# Altium schematic sheet Transconductance.SchDoc
size A4; SheetNumber: 2; SheetTotal: 3
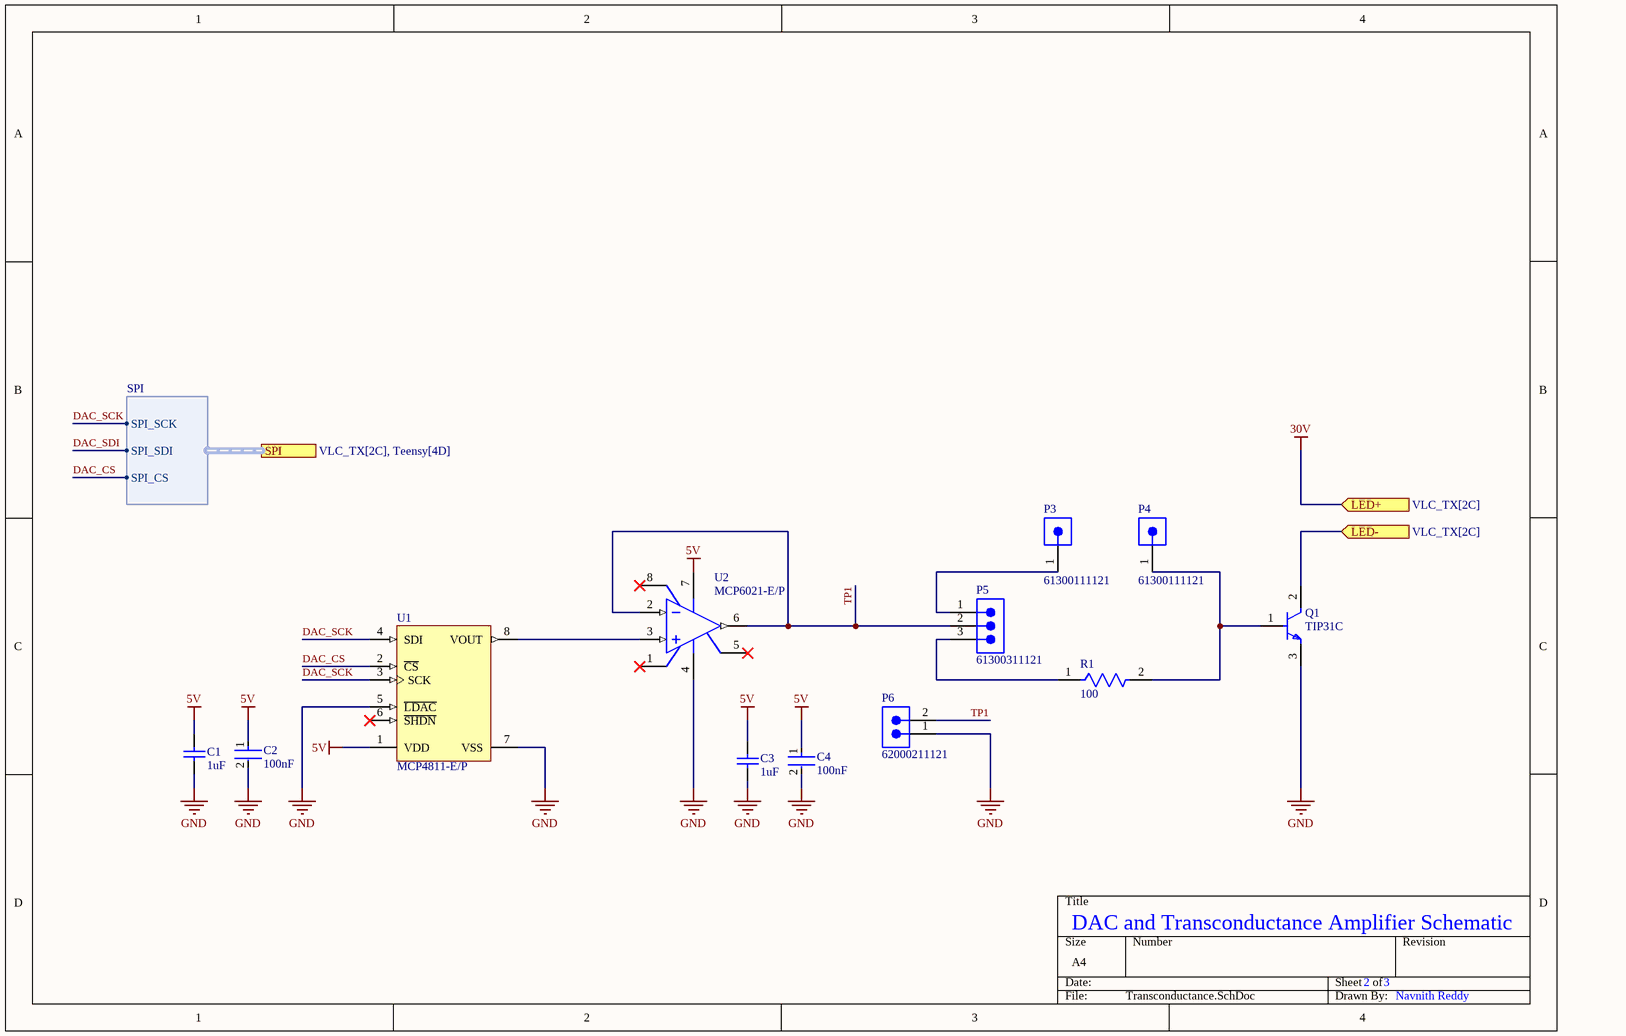
[diagram p0: Transconductance.SchDoc]

## Parts
C1  1uF  [CAPC2013X145X50LL20T25]
C2  100nF  [FP-C0805C-DN-MFG]
C3  1uF  [CAPC2013X145X50LL20T25]
C4  100nF  [FP-C0805C-DN-MFG]
P3  61300111121  [61300111121]
P4  61300111121  [61300111121]
P5  61300311121  [61300311121]
P6  62000211121  [62000211121]
Q1  TIP31C  [FP-TO-220-P0A0015988-MFG]
R1  100  [FP-TNPW0805-e3-MFG]
U1  MCP4811-E/P  [PDIP300-P8]
U2  MCP6021-E/P  [PDIP300-P8]

## Ports
LED+ (in, see VLC_TX[2C]), LED- (in, see VLC_TX[2C]), SPI (harness SPI, see VLC_TX[2C], Teensy[4D])

## Harnesses
SPI: SPI_SCK, SPI_SDI, SPI_CS

## Nets
5V: C1.2 C2.1 C3.2 C4.1 U1.1(VDD) U2.7(VDD)
30V: port LED+
GND: C1.1 C2.2 C3.1 C4.2 P6.1 Q1.3(E) U1.5(~{LDAC}) U1.7(VSS) U2.4(VSS)
DAC_CS: U1.2(~{CS}) ; port SPI.SPI_CS
DAC_SCK: U1.3(SCK) U1.4(SDI) ; port SPI.SPI_SCK
DAC_SDI: port SPI.SPI_SDI
LED-: Q1.2(C) ; port LED-
TP1: P5.2 P6.2 U2.2(VIN-) U2.6(VOUT)
NetP3_1: P3.1 P5.1
NetP4_1: P4.1 Q1.1(B) R1.2
NetP5_3: P5.3 R1.1
NetU1_8: U1.8(VOUT) U2.3(VIN+)

Not connected (* = marked no-connect by the designer): U1 6(~{SHDN})*; U2 1(NC)* 5(VREF)* 8(NC)*

## Notes on the sheet
- DAC and Transconductance Amplifier Schematic
- 2
- 3
- Navnith Reddy

## Library data of the parts
C1 C3 = CMP-1036-04746-2: Manufacturer: Kemet; Part Number: C0805C105K4PACTU
C2 C4 = CMP-2007-00274-2: CAP CER 0.1UF 16V X7R 0805; Manufacturer Part Number: C0805C104K4RACTU; Manufacturer: KEMET; Material: Ceramic; Tolerance: 0.1; Description: C0805 0.10 μF X7R 30ppm/°C 10.00% 16 V; Capacitance: 0.10 μF; Value: 0.10 μF; Temperature Coefficient: 30ppm/°C; Device Class L3: Ceramic Capacitors; RoHS: TRUE; Octopart: https://octopart.com/c0805c104k4ractu-kemet-92155; ComponentLink2Description: Datasheet; ComponentLink2URL: https://content.kemet.com/datasheets/KEM_C1003_C0G_SMD.pdf; Temperature Range High: +125°C; Category: Cap; Lead Free: Yes; Digikey Description: CAP CER 0.1UF 16V X7R 0805; Automotive: No; Temperature Range Low: -55°C; Voltage Rating: 16 V; Package: C0805C-DN; Ipc Land Pattern Name: CAPC200125X78; Height: 0.88mm; Device Class L1: Passive Components; Temperature: -55°C to +125°C; Mouser Description: Multilayer Ceramic Capacitors MLCC - SMD/SMT 16volts 0.1uF X7R 10%; Device Class L2: Capacitors; Temperature Characteristic: X7R
P3 P4 = CMP-1502-01058-2: NexarPartId: 32855518; Operating Supply Voltage: 250V; Connector Type: Male Pin; Contact Resistance: 20mΩ; Number of Contacts: 1; Gender: Male; Current Rating: 3A; Contact Mating Length: 5.9944mm; Number of Pins: 1; Lead Pitch: 2.54mm; Contact Plating: Gold; RoHS: Compliant; Termination: Solder; Mount: Through Hole; Number of Rows: 1; Orientation: Vertical; Contact Material: Copper; Packaging: Bulk; REACH SVHC: Unknown; Number of Positions: 1; Color: Black
P5 = CMP-1502-01062-2: NexarPartId: 32855521; Voltage Rating: 250V; Current Rating: 3A; Connector Type: Male Pin; Number of Positions: 3; Gender: Male; Contact Resistance: 20mΩ; Pitch: 2.54mm; Max Operating Temperature: 105°C; Lead Pitch: 2.54mm; Lead Free: Lead Free; Contact Mating Length: 5.9944mm; Contact Material: Copper; Number of Pins: 3; Orientation: Vertical; Height: 8.94mm; Packaging: Bulk; Min Operating Temperature: -40°C; Mount: Through Hole; RoHS: Compliant; Number of Contacts: 3; Operating Supply Voltage: 250V; Termination: Solder; Number of Rows: 1; Contact Plating: Gold; Color: Black; REACH SVHC: Unknown
P6 = CMP-1502-00956-3: NexarPartId: 61924778; Number of Contacts: 2; Voltage Rating: 200V; Gender: Male; Contact Resistance: 20mΩ; Current Rating: 2A; Lead Pitch: 2mm; Max Operating Temperature: 105°C; Contact Material: Gold; Number of Rows: 1; Operating Supply Voltage: 200V; Number of Pins: 2; Orientation: Vertical; Min Operating Temperature: -40°C; Height: 6.35mm; RoHS: Non-Compliant
Q1 = CMP-12195-000001-1: TRANS NPN 100V 3A TO-220; Manufacturer: STMicroelectronics; Hfe Max: 50; Number Of Npn: 1; Max Junction Temp: +150°C; Standoff Height: 3.5mm; Emitter Base Voltage: 5V; Collector Emitter Saturation Voltage: 1.2V; Power Dissipation: 2W; Hfe Testvce: 4V; Hfe Min: 10; Device Class L2: Transistors; ComponentLink2URL: https://www.st.com/resource/en/datasheet/tip31c.pdf; Device Class L1: Discrete Semiconductors; Digikey Description: TRANS NPN 100V 3A TO-220; Max Collector Current: 3A; RoHS: TRUE; Height: 19.68mm; Mouser Description: Bipolar Transistors - BJT NPN Gen Pur Power; Number Of Elements: 1; Package: TO-220-P0A0015988; Temperature: to +150°C; Octopart: https://octopart.com/tip31c-stmicroelectronics-15555; Manufacturer Part Number: TIP31C; Category: Trans; Hfe Testic: 3A; Lead Free: Yes; Collector Base Voltage: 100V; Device Class L3: BJTs; Collector Emitter Voltage: 100V; Automotive: No; ComponentLink2Description: Datasheet; Temperature Range High: +150°C
R1 = CMP-2001-04723-2: NexarPartId: 42014021; Working Voltage: 150V; Power Rating: 125mW; Voltage Rating (DC): 100V; Temperature Coefficient: 25ppm/°C; Resistance: 100Ω; Tolerance: 1%; Case Code (Metric): 2012; Max Operating Temperature: 125°C; Schedule B: 8533210045, 8533210045; Military Standard: Not; Case Code (Imperial): 0805; Voltage Rating: 150V; Number of Terminations: 2; REACH SVHC: No SVHC; Weight: 5.499807mg; Lead Free: Lead Free; Radiation Hardening: No; RoHS: Compliant; Termination: SMD/SMT; Min Operating Temperature: -55°C; Width: 1.2mm; Height: 450µm; Contact Plating: Tin; Composition: Thin Film; Packaging: Cut Tape; Length: 2mm; Depth: 1.25mm; Case/Package: 0805; Number of Pins: 2
U1 = CMP-0188-01069-1: 10-Bit DACs with Internal VREF and SPI Interface, 8-Pin PDIP, Extended Temperature; ComponentLink3Description: Package Specification; ComponentLink2Description: Datasheet; Code_JEDEC: MS-001; ComponentLink1Description: Manufacturer URL; ComponentLink3URL: http://www.microchip.com/stellent/groups/techpub_sg/documents/packagingspec/en012702.pdf; ComponentLink1URL: http://www.microchip.com/; DatasheetVersion: revB, Apr-2010; PackageReference: PDIP300-P8; PackageVersion: revBB, Aug-2009; ComponentLink2URL: http://ww1.microchip.com/downloads/en/DeviceDoc/22244B.pdf; PackageDescription: 8-Lead Plastic Dual In-Line (P) - 300 mil Body [PDIP]
U2 = CMP-0187-00675-2: None; Common Mode Rejection Ratio: 70dB; Number of Channels: 1; Power Supply Rejection Ratio (PSRR): 74dB; Min Supply Voltage: 2.5V; Input Offset Voltage (Vos): 250uV; Operating Supply Current: 1mA; Bandwidth: 10MHz; Amplifier Type: GENERAL PURPOSE; Output Current per Channel: 30mA; Max Supply Voltage: 5.5V; Input Bias Current: 1pA; Voltage Gain: 110dB; Output Current: 22mA; Slew Rate: 7V/µs; Lead Free: Lead Free; Technology: CMOS; Height: 0.195inch; REACH SVHC: No SVHC; Length: 0.4inch; Packaging: Rail/Tube; Package Quantity: 60; Mount: Through Hole; Max Operating Temperature: 125°C; RoHS Compliant: Yes; Number of Elements: 1; Harmonic Distortion: 0.00053%; Case/Package: PDIP; Radiation Hardening: No; Nominal Supply Current: 1mA; Number of Circuits: 1; Number of Pins: 8; Width: 0.28inch; Supply Current: 1mA; Gain Bandwidth Product: 10MHz; Number of Amplifiers: 1; Min Operating Temperature: -40°C; Unity Gain Bandwidth Product: 10MHz